# Altium schematic sheet InnerMaskFinal.SchDoc
size A; SheetNumber: 1; SheetTotal: 1
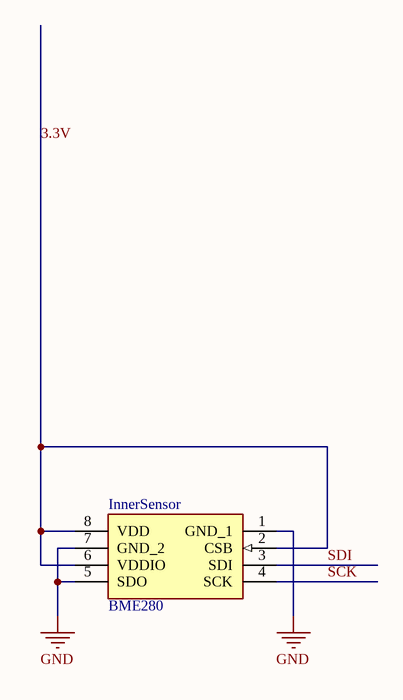
[diagram p0: InnerMaskFinal.SchDoc]

## Parts
InnerSensor  BME280  [BME280]

## Nets
GND: InnerSensor.1(GND_1) InnerSensor.5(SDO) InnerSensor.7(GND_2)
3.3V: InnerSensor.2(CSB) InnerSensor.6(VDDIO) InnerSensor.8(VDD)
SCK: InnerSensor.4(SCK)
SDI: InnerSensor.3(SDI)

## Library data of the parts
InnerSensor = BME280: Hygrometer; Manufacturer_Name: Bosch Sensortec; Datasheet Link: http://ae-bst.resource.bosch.com/media/products/dokumente/bme280/BST-BME280_DS001-11.pdf; Manufacturer_Part_Number: BME280; Arrow Part Number: BME280; Arrow Price/Stock: https://www.arrow.com/en/products/bme280/bosch; Mouser Part Number: 262-BME280; Mouser Price/Stock: https://www.mouser.co.uk/ProductDetail/Bosch-Sensortec/BME280?qs=2OnyuXx6vpj2fK9HX7qb3g%3D%3D